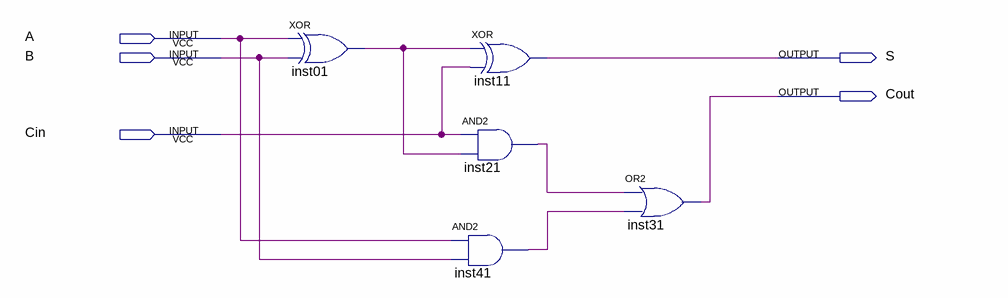
[diagram p0: schematic sheet]
// Quartus schematic 1_esc_somador1bit.bdf as structural Verilog: 5 symbols, 5 pins
module \1_esc_somador1bit  (
  input  A,
  input  B,
  input  Cin,
  output S,
  output Cout
);

  wire inst01_out, inst21_out, inst41_out;

  xor inst01 (inst01_out, A, B);
  xor inst11 (S, inst01_out, Cin);
  and inst21 (inst21_out, Cin, inst01_out);
  and inst41 (inst41_out, A, B);
  or inst31 (Cout, inst21_out, inst41_out);
endmodule
